# EAGLE schematic Lazy Frog (EAGLE 6.6.0)
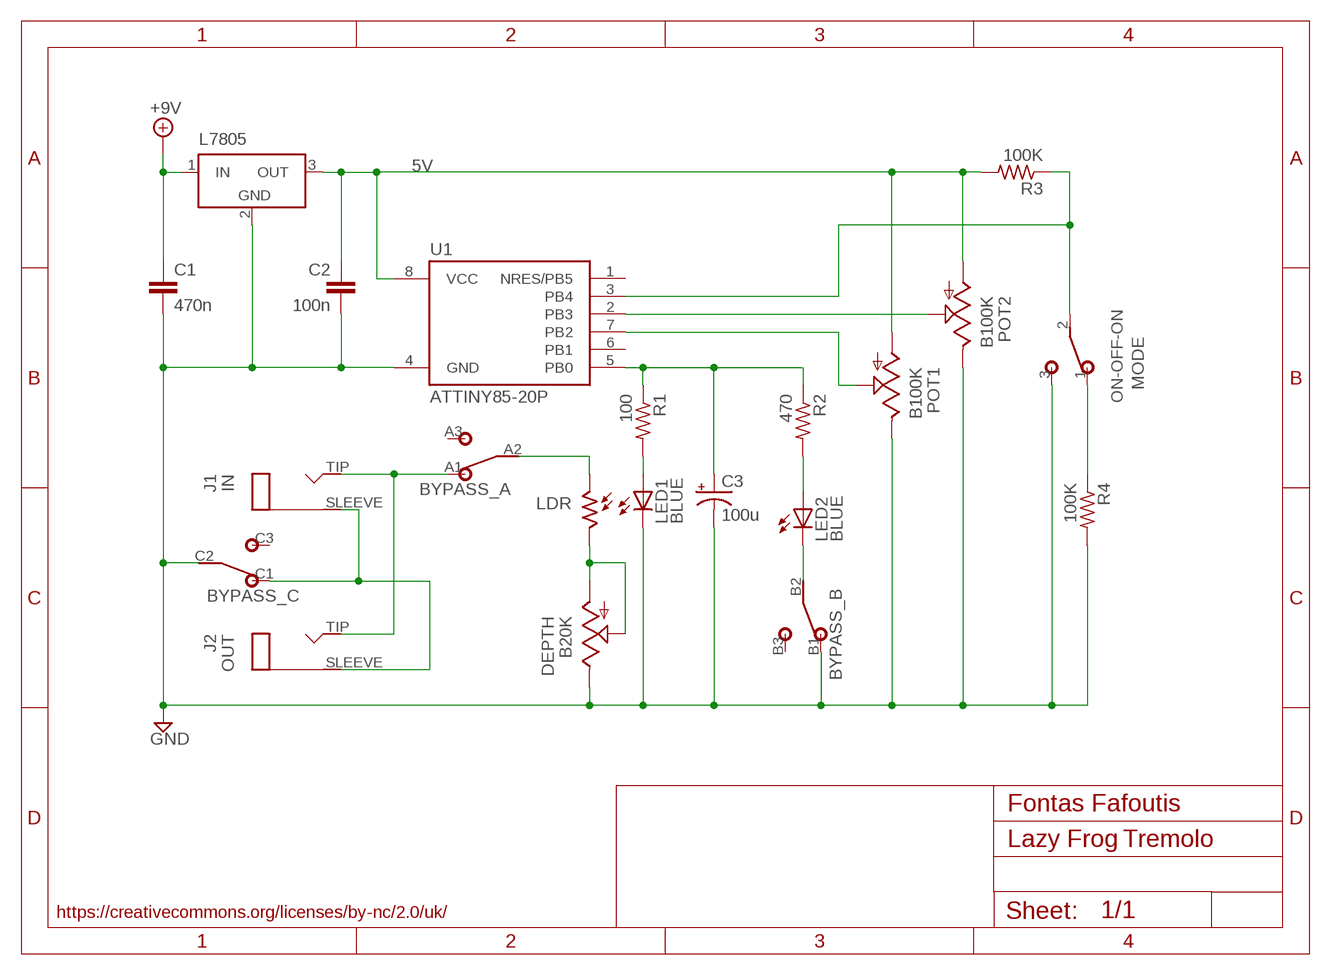
[diagram p0: schematic, sheet 1]

## Parts
BYPASS_  3PDT  [3PDT]
C1  470n  072X0352  [072X035]
C2  100n  072X0352  [072X035]
C3  100u  0631  [063_025]
DEPTH  B20K  TRIM_US-3223G  [3223G]
J1  IN  MONO  [MONO_JACK]
J2  OUT  MONO  [MONO_JACK]
L7805  LT1129CST5  [SOT223]
LDR  PHOTOCELLD11  [D11XX_H]
LED1  BLUE  LED  [SMARTLED-TTW]
LED2  BLUE  LED  [SMARTLED-TTW]
MODE  ON-OFF-ON  SPDTPADS  [SPDT]
POT1  B100K  TRIM_US-3223G  [3223G]
POT2  B100K  TRIM_US-3223G  [3223G]
R1  100  R-US_0204/7  [0204/7]
R2  470  R-US_0204/7  [0204/7]
R3  100K  R-US_0204/7  [0204/7]
R4  100K  R-US_0204/7  [0204/7]
U1  ATTINY85-20P  [PDIP08_300MIL]

## Nets
5V: C2.1 L7805.3(OUT) POT1.1(A) POT2.1(A) R3.2 U1.8(VCC)
+9V: C1.1 L7805.1(IN)
BYPASS: BYPASS_.A1 J1.TIP J2.TIP
GND: BYPASS_.B1 BYPASS_.C2 C1.2 C2.2 C3.- DEPTH.3(E) L7805.2(GND) LED1.C@1(C) MODE.3(S) POT1.3(E) POT2.3(E) R4.2 U1.4(GND)
N$1: POT2.2(S) U1.2(PB3)
N$2: BYPASS_.C1 J1.SLEEVE J2.SLEEVE
N$3: POT1.2(S) U1.7(PB2)
N$4: BYPASS_.A2 LDR.1
N$5: MODE.2(P) R3.1 U1.3(PB4)
N$6: BYPASS_.B2 LED2.C@1(C)
N$7: MODE.1(O) R4.1
N$9: C3.+ R1.1 R2.1 U1.5(PB0)
N$10: LED2.A@1(A) R2.2
N$11: LED1.A@1(A) R1.2
N$13: DEPTH.1(A) DEPTH.2(S) LDR.2
Unconnected: BYPASS_.A3 BYPASS_.B3 BYPASS_.C3 U1.1(NRES/PB5) U1.6(PB1)

## Notes on the sheet
- ON-OFF-ON
- Fontas Fafoutis
- Tremolo
- https://creativecommons.org/licenses/by-nc/2.0/uk/

## Power pins joined to a net without a drawn wire
GND: L7805.4(GND)

## Library data of the parts
BYPASS_ = gm-switches:3PDT
C1 C2 = gm-caps-film-box:072X035: 0.15 - 1.0uF; WIMA MKP2 63, 100V: 0.047uF; MKS2 50V: 0.68 - 1.0uF; 63V: 0.33 - 0.47uF; 100V: 0.15 - 0.22uF;
C3 = gm-caps-electro-pol:063: 33 - 220uF Xicon values at Mouser.com 10V: 220uF; 16V: 100uF; 25V: 100uF; 50V: 33uF
DEPTH POT1 POT2 = pot:TRIM_US-: POTENTIOMETER
J1 J2 = gm-jacks:MONO: Mono 1/4" Phone Jack
L7805 = linear-technology:LT1129CST5: VOLTAGE REGULATOR with shutdown; MPN: LT1129CST-5#PBF; OC_FARNELL: 1663375; OC_NEWARK: 57M2069
LDR = photo-elements:PHOTOCELL: Photo Sensor
LED1 LED2 = led:LED: LED OSRAM: - CHIPLED LG R971, LG N971, LY N971, LG Q971, LY Q971, LO R971, LY R971 LH N974, LH R974 LS Q976, LO Q976, LY Q976 LO Q996 - Hyper CHIPLED LW Q18S LB Q993, LB Q99A, LB R99A - SideLED LS A670, LO A670, LY A670, LG A670, LP A670 LB A673, LV A673, LT A673, LW A673 LH A674 LY A675 LS A676, LA A676, LO A676, LY A676, LW A676 LS A679, LY A679, LG A679 - Hyper Micro SIDELED® LS Y876, LA Y876, LO Y876, LY Y876 LT Y87S - SmartLED LW L88C, LW L88S LB L89C, LB L89S, LG L890 LS L89K, LO L89K, LY L89K LS L896, LA L896, LO L896, LY L896 - TOPLED LS T670, LO T670, LY T670, LG T670, LP T670 LSG T670, LSP T670, LSY T670, LOP T670, LYG T670 LG T671, LOG T671, LSG T671 LB T673, LV T673, LT T673, LW T673 LH T674 LS T676, LA T676, LO T676, LY T676, LB T676, LH T676, LSB T676, LW T676 LB T67C, LV T67C, LT T67C, LS T67K, LO T67K, LY T67K, LW E67C LS E67B, LA E67B, LO E67B, LY E67B, LB E67C, LV E67C, LT E67C LW T67C LS T679, LY T679, LG T679 LS T770, LO T770, LY T770, LG T770, LP T770 LB T773, LV T773, LT T773, LW T773 LH T774 LS E675, LA E675, LY E675, LS T675 LS T776, LA T776, LO T776, LY T776, LB T776 LHGB T686 LT T68C, LB T68C - Hyper Mini TOPLED® LB M676 - Mini TOPLED Santana® LG M470 LS M47K, LO M47K, LY M47K Source: http://www.osram.convergy.de LUXEON: - LUMILED® LXK2-PW12-R00, LXK2-PW12-S00, LXK2-PW14-U00, LXK2-PW14-V00 LXK2-PM12-R00, LXK2-PM12-S00, LXK2-PM14-U00 LXK2-PE12-Q00, LXK2-PE12-R00, LXK2-PE12-S00, LXK2-PE14-T00, LXK2-PE14-U00 LXK2-PB12-K00, LXK2-PB12-L00, LXK2-PB12-M00, LXK2-PB14-N00, LXK2-PB14-P00, LXK2-PB14-Q00 LXK2-PR12-L00, LXK2-PR12-M00, LXK2-PR14-Q00, LXK2-PR14-R00 LXK2-PD12-Q00, LXK2-PD12-R00, LXK2-PD12-S00 LXK2-PH12-R00, LXK2-PH12-S00 LXK2-PL12-P00, LXK2-PL12-Q00, LXK2-PL12-R00 Source: www.luxeon.com KINGBRIGHT: KA-3528ASYC Source: www.kingbright.com
MODE = gm-switches:SPDT: TOGGLE SWITCH Marquardt
R1-R4 = resistor:R-US_: RESISTOR, American symbol
U1 = _hhn_attiny25_45_85:ATTINY85*: ATMEL ATtiny 85 Packages: P = PDIP 08 30mil S = SOIC 08 EIAJ 208mil Technologies Note: for complete ordering code (temp. range, finish, tape&reel etc.) see www.atmel.com • Supply Voltage: V = (1.8…5.5)V | [blank] = (2.7…5.5)V • Speed: 10 = 10 MHz | 20 = 20 MHz Author: Dipl.-Ing. FH Rainer Bayer HHN Hochschule Heilbronn (Heilbronn University), rainer.bayer@hs-heilbronn.de Ingenieurbüro ing-rb, mail@ing-rb.de